# EAGLE design CV_LEDControl (EAGLE 9.5.2)
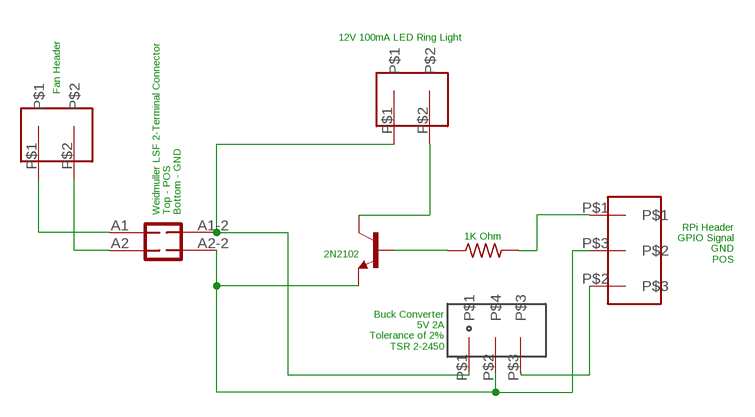
[diagram p0: schematic, sheet 1]

## Parts
R1  R-US_0204/7  [0204/7]
T1  2N2102  [TO5]
U$1  TSR2-2450  [TSR2]
U$2  2-PORTTERMINAL-26AWG  [2-PORTTERMINAL-26AWG]
U$3  2-PORTTERMINAL-22AWG  [2-PORTTERMINAL-22AWG]
U$4  3-PORTTERMINAL-22AWG  [3-PORTTERMINAL-22AWG]
WEIDMULLERLSF  WEIDMUELLER_1824420000WEIDMUELLER_1824420000_0_0  [WEIDMUELLER_1824420000_0]

## Nets
N$1: U$2.P$1 WEIDMULLERLSF.A1(A4)
N$2: U$2.P$2 WEIDMULLERLSF.A2(A3)
N$3: U$1.P$1 U$3.P$1 WEIDMULLERLSF.A1-2(A1)
N$4: T1.3(C) U$3.P$2
N$5: R1.2 U$4.P$1
N$6: R1.1 T1.2(B)
N$7: T1.1(E) U$1.P$2 U$4.P$3 WEIDMULLERLSF.A2-2(A2)
N$8: U$1.P$3 U$4.P$2

## Notes on the sheet
- 12V 100mA LED Ring Light
- Fan Header
- Weidmuller LSF 2-Terminal Connector
  Top - POS
  Bottom - GND
- RPi Header
  GPIO Signal
  GND
  POS
- 1K Ohm
- 2N2102
- Buck Converter
  5V 2A
  Tolerance of 2%
  TSR 2-2450

## Library data of the parts
R1 = rcl:R-US_: RESISTOR, American symbol; SPICEPREFIX: R
T1 = transistor-neu-to92:2N2102: NPN TRANSISTOR
U$1 = T Buck Converter:TSR2-2450
U$2 = T Buck Converter:2-PORTTERMINAL-26AWG
U$3 = T Buck Converter:2-PORTTERMINAL-22AWG
U$4 = T Buck Converter:3-PORTTERMINAL-22AWG
WEIDMULLERLSF = Weidmueller - 1824420000:WEIDMUELLER_1824420000: Terminal_02_1x02; CIIVA_IDS: 751615; COLOUR: Black; COMPONENT_LINK_1_DESCRIPTION: Manufacturer URL; COMPONENT_LINK_1_URL: http://www.weidmueller.com/; COMPONENT_LINK_2_DESCRIPTION: URL Link1; COMPONENT_LINK_2_URL: http://catalog.weidmueller.com/catalog/Start.do?localeId=en&ObjectID=1824420000; CONTACT_MATERIAL: Cu-Leg; CONTACT_SURFACE: tinned; FOOTPRINT_VARIANT_NAME_0: Manufacturer Recommended; IMPORTED: yes; IMPORTED_FROM: vault; IMPORT_TS: 1521843294; INSULATING_MATERIAL: LCP GF; MF: Weidmueller; MOUNTING_ONTO_THE__PCB: Reflow solder connection; MPN: 1824420000; NO_OF_POLES: 2; PACKAGE: LSF_SMT_3_5_90_02; PACKAGING: Tube; PITCH_INCH: 0,138 inch; PITCH_MM: 3,5 mm; PREFIX: E; QTY: 71 PCS; RATED_CURRENT_MIN_NO_OF_POLES__TU__20_DEG__C: 19 A; RATED_CURRENT_USE_GROUP__B__UL__1059: 12 A; RATED_VOLTAGE_FOR_SURGE_VOLTAGE_CLASS_POLLUTION_DEGREE__II__2: 320 V; RATED_VOLTAGE_USE_GROUP__B__UL__1059: 300 V; RELEASE_DATE: 1441960090; REVISION: V1; SHORT_TEXT_FOR_MATERIAL: LSF-SMT 3.50/02/90 3.5SN BK TU; SIDE_TERMINATION_CHARACTERISTIC: closed side; SOLDER_PIN_LENGTH_MM: 3,5 mm; SOLID_MAX__H_05__07__V__U: 1,5 mm2; SOLID_MIN__H_05__07__V__U: 0,2 mm2; UL__94_FLAMMABILITY_RATING: V-0; VAULT_GUID: 89E33B9A-043A-4874-A203-05FDB513CC7C; VAULT_REVISION: 596C6C24-1937-47C0-8FB5-6E30F0E03674; WIRE_CROSS_SECTION__AWG_MAX__UL__1059: AWG 16; WIRE_CROSS_SECTION__AWG_MIN__UL__1059: AWG 24

## Board
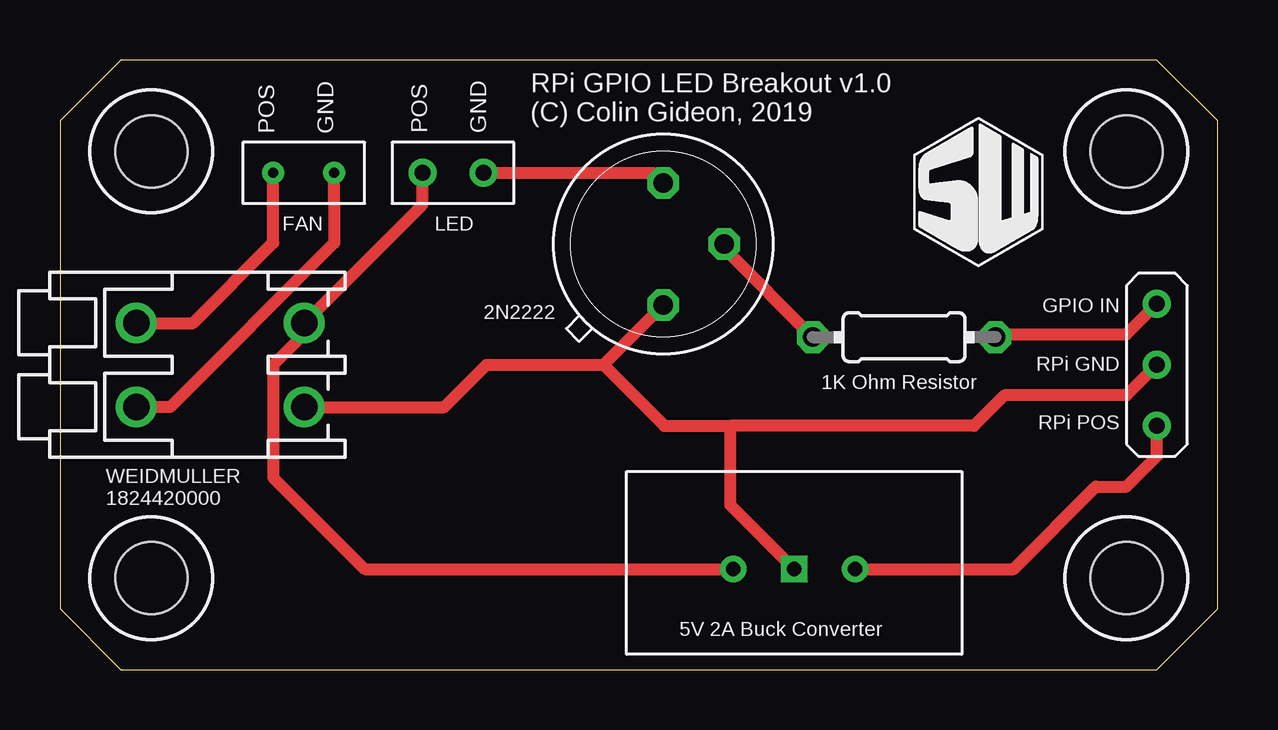
[diagram p1: board, top side]
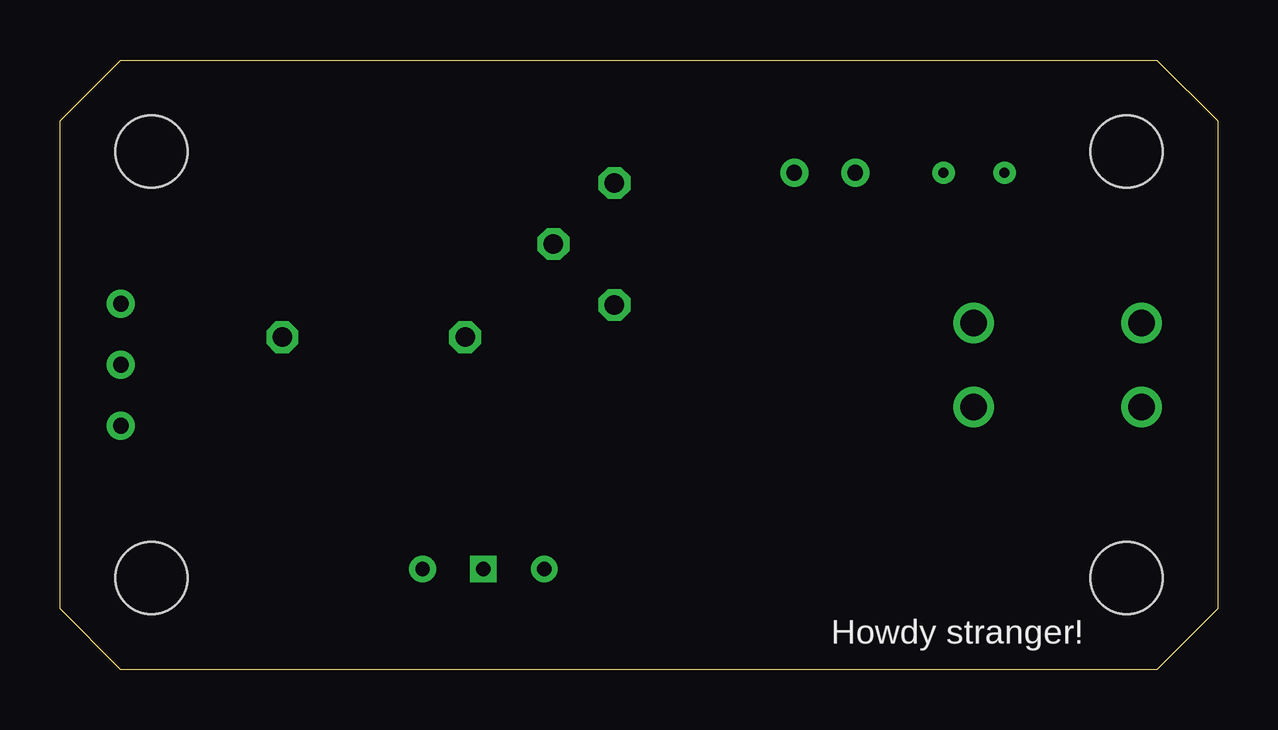
[diagram p2: board, bottom side, seen from below]

Size 48.26 x 25.4 mm. Coordinates in mm from the lower left corner, seen from the top.
Outline: 2.54,0 45.72,0 48.26,2.54 48.26,22.86 45.72,25.4 2.54,25.4 0,22.86 0,2.54 2.54,0
Copper layers (1*16): Top 0.035mm / dielectric 1.5mm / Bottom 0.035mm
Design rules "default": minimum track width 6mil, minimum drill 0.35mm, track to track 6mil, track to pad 6mil, pad to pad 6mil, via to via 6mil, smd to smd 6mil, copper to edge 40mil, drill to drill 6mil, minimum pad ring 10mil, minimum via ring 8mil, stop-mask expansion 4mil, vias tented up to drill 0mil, thermal gap 10mil
Holes 3 mm at 3.81,3.81 44.45,3.81 44.45,21.59 3.81,21.59

### Footprints (pad centres in the part's own frame; a part is rotated, then mirrored left to right if it is on the bottom)
0204/7 = drill 0.813 octagon: 1 -3.81,0; 2 3.81,0
TO5 = drill 0.813 octagon: 1 0,-2.54; 2 2.54,0; 3 0,2.54
TSR2 = drill 0.6: P$1 4.445,3.556; P$3 9.525,3.556 | drill 0.6 square: P$2 6.985,3.556
2-PORTTERMINAL-26AWG = drill 0.419: P$1 1.27,1.27; P$2 3.81,1.27
2-PORTTERMINAL-22AWG = drill 0.66: P$1 1.27,1.27; P$2 3.81,1.27
3-PORTTERMINAL-22AWG = drill 0.66: P$1 1.27,1.27; P$2 6.35,1.27; P$3 3.81,1.27
WEIDMUELLER_1824420000_0 = drill 1.1 pad 1.7: A1 -1.74,-1.9; A1-2 -1.74,5.1; A2 1.76,-1.9; A2-2 1.76,5.1

### Placement (x,y rotation side)
R1  35.18,13.85 0 top
T1  25.15,17.73 0 top
U$1  23.62,0.64 0 top
U$2  7.62,19.43 0 top
U$3  13.84,19.43 0 top
U$4  44.45,16.51 270 top
WEIDMULLERLSF  5.08,12.7 270 top

### Tracks (layer width: path | path; a pad name or v marks a point on that pad's centre or on a via)
N$1
  Top 0.508: WEIDMULLERLSF.A1 5.55,14.44 8.89,17.78 U$2.P$1
N$2
  Top 0.508: WEIDMULLERLSF.A2 4.59,10.94 11.43,17.78 11.43,19.05 11.43,19.46 U$2.P$2
N$3
  Top 0.152: WEIDMULLERLSF.A1-2 10.18,13.99
  Top 0.508: 10.18,13.99 8.89,12.7 8.89,8 12.7,4.19 U$1.P$1 | U$3.P$1 15.11,19.37 WEIDMULLERLSF.A1-2
N$4
  Top 0.508: U$3.P$2 24.72,20.7 T1.3
N$5
  Top 0.152: R1.2 39.12,13.97
  Top 0.508: 39.12,13.97 44.45,13.97 U$4.P$1
N$6
  Top 0.152: T1.2 27.69,17.54
  Top 0.508: 27.69,17.54 R1.1
N$7
  Top 0.508: WEIDMULLERLSF.A2-2 16.02,10.94 17.78,12.7 22.65,12.7 | 22.65,12.7 T1.1 | 22.65,12.7 25.19,10.16 27.94,10.16 | 27.94,10.16 38.1,10.16 39.37,11.43 44.45,11.43 U$4.P$3 | U$1.P$2 27.94,6.86 27.94,10.16
N$8
  Top 0.508: U$1.P$3 39.75,4.19 43.18,7.62 44.45,7.62 45.72,8.89 U$4.P$2

### Text on the board
tPlace: RPi GPIO LED Breakout v1.0 / (C) Colin Gideon, 2019 | POS / GND | POS / GND | FAN | LED | 2N2222 | 1K Ohm Resistor | GPIO IN / / RPi GND / / RPi POS | WEIDMULLER / 1824420000 | 5V 2A Buck Converter
bPlace: Howdy stranger!